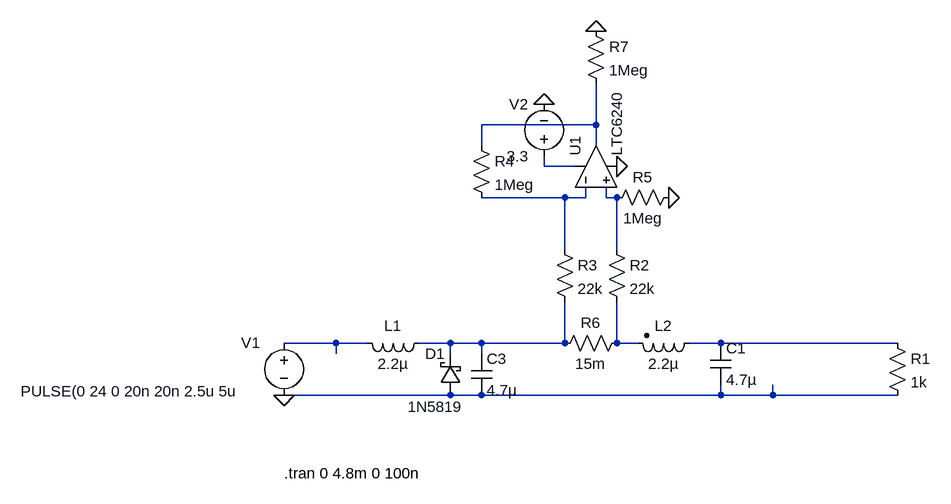
[diagram p0: schematic filter buck converter.asc]
filter buck converter.asc, the LTspice schematic file:
Version 4
SHEET 1 996 944
WIRE 448 -176 448 -240
WIRE 448 -176 272 -176
WIRE 272 -144 272 -176
WIRE 448 -144 448 -176
WIRE 368 -112 368 -128
WIRE 416 -112 368 -112
WIRE 400 -64 272 -64
WIRE 432 -64 432 -80
WIRE 432 -64 400 -64
WIRE 464 -64 464 -80
WIRE 480 -64 464 -64
WIRE 400 16 400 -64
WIRE 480 16 480 -64
WIRE 48 160 -32 160
WIRE 96 160 48 160
WIRE 224 160 176 160
WIRE 272 160 224 160
WIRE 400 160 400 96
WIRE 400 160 272 160
WIRE 480 160 480 96
WIRE 512 160 480 160
WIRE 640 160 592 160
WIRE 912 160 640 160
WIRE 48 176 48 160
WIRE 224 176 224 160
WIRE 272 176 272 160
WIRE 224 240 -32 240
WIRE 272 240 224 240
WIRE 640 240 640 224
WIRE 640 240 272 240
WIRE 720 240 720 224
WIRE 720 240 640 240
WIRE 912 240 720 240
FLAG -32 240 0
FLAG 480 -112 0
FLAG 560 -64 0
FLAG 368 -208 0
FLAG 448 -320 0
SYMBOL voltage -32 144 R0
WINDOW 123 0 0 Left 0
WINDOW 39 0 0 Left 0
WINDOW 0 -66 15 Left 2
WINDOW 3 -405 90 Left 2
SYMATTR InstName V1
SYMATTR Value PULSE(0 24 0 20n 20n 2.5u 5u
SYMBOL cap 624 160 R0
SYMATTR InstName C1
SYMATTR Value 4.7µ
SYMATTR SpiceLine V=35 Rser=0.002
SYMBOL ind 192 144 R90
WINDOW 0 5 56 VBottom 2
WINDOW 3 32 56 VTop 2
SYMATTR InstName L1
SYMATTR Value 2.2µ
SYMATTR SpiceLine Ipk=8 Rser=10m Rpar=0 Cpar=0
SYMBOL res 896 144 R0
SYMATTR InstName R1
SYMATTR Value 1k
SYMBOL schottky 240 240 R180
WINDOW 0 24 64 Left 2
WINDOW 3 -3 -18 Left 2
SYMATTR InstName D1
SYMATTR Value 1N5819
SYMATTR Description Diode
SYMATTR Type diode
SYMBOL ind2 608 144 R90
WINDOW 0 5 56 VBottom 2
WINDOW 3 32 56 VTop 2
SYMATTR InstName L2
SYMATTR Value 2.2µ
SYMATTR Type ind
SYMATTR SpiceLine Ipk=8 Rser=10m
SYMBOL cap 256 176 R0
SYMATTR InstName C3
SYMATTR Value 4.7µ
SYMBOL res 496 144 R90
WINDOW 0 0 56 VBottom 2
WINDOW 3 32 56 VTop 2
SYMATTR InstName R6
SYMATTR Value 15m
SYMBOL Opamps\\LTC6240 448 -112 R270
SYMATTR InstName U1
SYMBOL res 464 0 R0
SYMATTR InstName R2
SYMATTR Value 22k
SYMBOL res 384 0 R0
SYMATTR InstName R3
SYMATTR Value 22k
SYMBOL res 256 -160 R0
SYMATTR InstName R4
SYMATTR Value 1Meg
SYMBOL res 576 -80 R90
WINDOW 0 0 56 VBottom 2
WINDOW 3 32 56 VTop 2
SYMATTR InstName R5
SYMATTR Value 1Meg
SYMBOL voltage 368 -112 R180
WINDOW 0 24 96 Left 2
WINDOW 3 24 16 Left 2
SYMATTR InstName V2
SYMATTR Value 3.3
SYMBOL res 432 -336 R0
SYMATTR InstName R7
SYMATTR Value 1Meg
TEXT -32 360 Left 2 !.tran 0 4.8m 0 100n

The netlist it stands for:
* filter buck converter.asc
V1 N005 0 PULSE(0 24 0 20n 20n 2.5u 5u
C1 N008 0 4.7µ V=35 Rser=0.002
L1 N006 N005 2.2µ Ipk=8 Rser=10m Rpar=0 Cpar=0
R1 N008 0 1k
D1 0 N006 1N5819
L2 N008 N007 2.2µ Ipk=8 Rser=10m
C3 N006 0 4.7µ
R6 N007 N006 15m
* U1: LTC6240 (symbol Opamps\LTC6240 not available, pins judged from their places): In+=N004 In-=N003 V+=N002 V-=0 OUT=N001
R2 N004 N007 22k
R3 N003 N006 22k
R4 N001 N003 1Meg
R5 0 N004 1Meg
V2 N002 0 3.3
R7 0 N001 1Meg
.model D D
.lib standard.dio
.tran 0 4.8m 0 100n
.backanno
.end